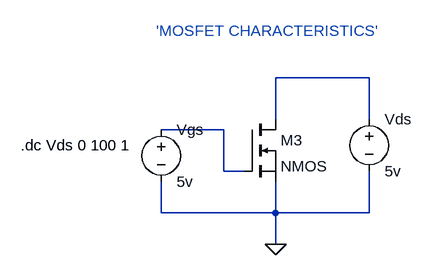
[diagram p0: schematic 8.Mosfet Characteristics.asc]
8.Mosfet Characteristics.asc, the LTspice schematic file:
Version 4
SHEET 1 880 680
WIRE 448 112 304 112
WIRE 304 176 304 112
WIRE 448 176 448 112
WIRE 224 192 128 192
WIRE 224 256 224 192
WIRE 256 256 224 256
WIRE 128 320 128 272
WIRE 304 320 304 272
WIRE 304 320 128 320
WIRE 448 320 448 256
WIRE 448 320 304 320
WIRE 304 368 304 320
FLAG 304 368 0
SYMBOL nmos 256 176 R0
SYMATTR InstName M3
SYMBOL voltage 448 160 R0
WINDOW 123 0 0 Left 0
WINDOW 39 0 0 Left 0
SYMATTR InstName Vds
SYMATTR Value 5v
SYMBOL voltage 128 176 R0
SYMATTR InstName Vgs
SYMATTR Value 5v
TEXT -88 216 Left 2 !.dc Vds 0 100 1
TEXT 120 40 Left 2 ;'MOSFET CHARACTERISTICS'

The netlist it stands for:
* 8.Mosfet Characteristics.asc
M3 N001 N002 0 0 NMOS
Vds N001 0 5v
Vgs N002 0 5v
.model NMOS NMOS
.model PMOS PMOS
.lib standard.mos
.dc Vds 0 100 1
* 'MOSFET CHARACTERISTICS'
.backanno
.end